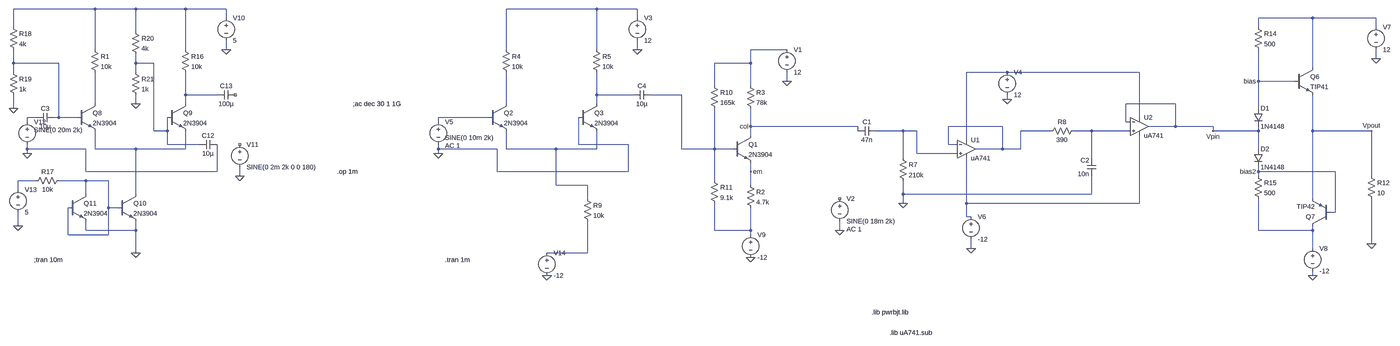
[diagram p0: schematic ampsave.asc, whole sheet]
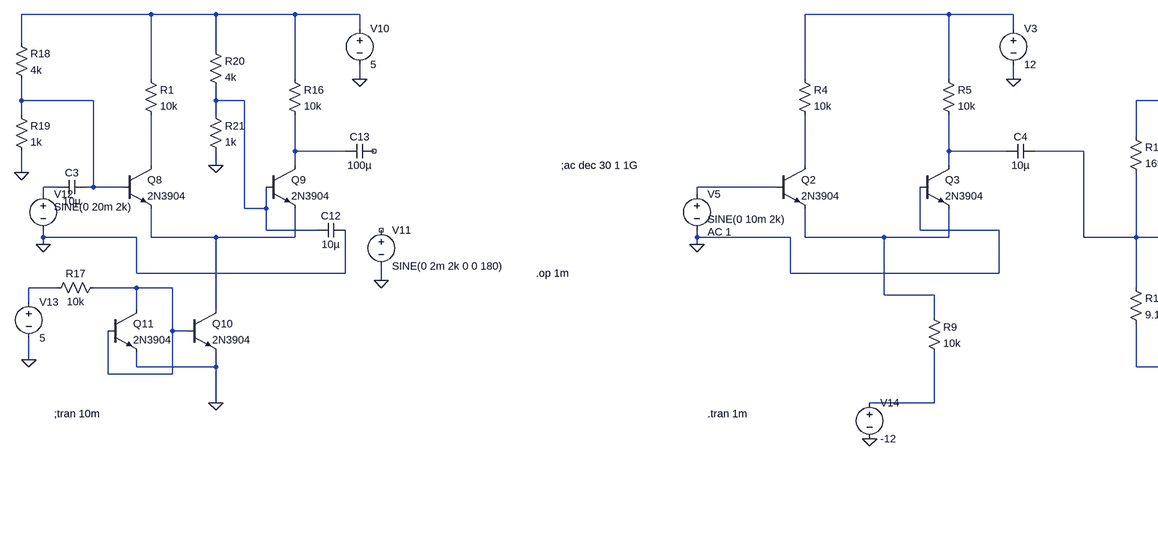
[diagram p1: schematic ampsave.asc, part, row 1 of 1, column 1 of 2]
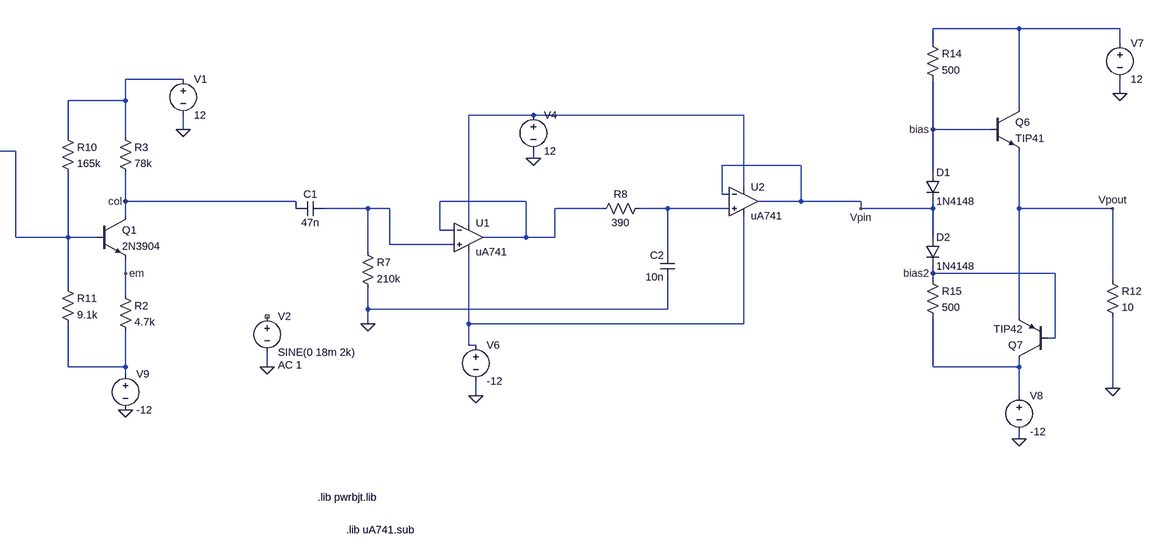
[diagram p2: schematic ampsave.asc, part, row 1 of 1, column 2 of 2]
ampsave.asc, the LTspice schematic file:
Version 4
SHEET 1 3068 1096
WIRE -2784 -352 -3072 -352
WIRE -2640 -352 -2784 -352
WIRE -2464 -352 -2640 -352
WIRE -2320 -352 -2464 -352
WIRE -880 -352 -1200 -352
WIRE -736 -352 -880 -352
WIRE -2320 -320 -2320 -352
WIRE -736 -320 -736 -352
WIRE 2672 -320 2480 -320
WIRE 2896 -320 2672 -320
WIRE -3072 -288 -3072 -352
WIRE 2480 -288 2480 -320
WIRE 2896 -288 2896 -320
WIRE -2640 -272 -2640 -352
WIRE -2784 -208 -2784 -352
WIRE -2464 -208 -2464 -352
WIRE -2320 -208 -2320 -240
WIRE -1200 -208 -1200 -352
WIRE -880 -208 -880 -352
WIRE -736 -208 -736 -240
WIRE 336 -208 208 -208
WIRE 2896 -176 2896 -208
WIRE -3072 -160 -3072 -208
WIRE -2912 -160 -3072 -160
WIRE -2640 -160 -2640 -192
WIRE -2576 -160 -2640 -160
WIRE 208 -160 208 -208
WIRE 208 -160 80 -160
WIRE 2672 -144 2672 -320
WIRE -3072 -128 -3072 -160
WIRE -2640 -128 -2640 -160
WIRE 1120 -128 976 -128
WIRE 1776 -128 1120 -128
WIRE 336 -96 336 -128
WIRE 2480 -96 2480 -208
WIRE 2608 -96 2480 -96
WIRE 80 -80 80 -160
WIRE 208 -80 208 -160
WIRE -2464 -48 -2464 -128
WIRE -2352 -48 -2464 -48
WIRE -880 -48 -880 -128
WIRE -752 -48 -880 -48
WIRE -48 -48 -688 -48
WIRE 1120 -32 1120 -48
WIRE -2784 -16 -2784 -128
WIRE -2640 -16 -2640 -48
WIRE -2464 -16 -2464 -48
WIRE -1200 -16 -1200 -128
WIRE -880 -16 -880 -48
WIRE 1904 -16 1728 -16
WIRE -3072 0 -3072 -48
WIRE 2480 0 2480 -96
WIRE -2992 32 -3024 32
WIRE -2912 32 -2912 -160
WIRE -2912 32 -2928 32
WIRE -2848 32 -2912 32
WIRE -1264 32 -1440 32
WIRE 1776 32 1776 -128
WIRE -3024 48 -3024 32
WIRE -1440 48 -1440 32
WIRE 1728 48 1728 -16
WIRE 1744 48 1728 48
WIRE 208 64 208 0
WIRE 592 64 208 64
WIRE 1104 64 912 64
WIRE 1904 64 1904 -16
WIRE 1904 64 1808 64
WIRE 2320 64 1904 64
WIRE -2576 80 -2576 -160
WIRE -2528 80 -2528 32
WIRE -2528 80 -2576 80
WIRE 592 80 592 64
WIRE 752 80 656 80
WIRE 800 80 752 80
WIRE 1296 80 1168 80
WIRE 1440 80 1376 80
WIRE 1744 80 1440 80
WIRE 2320 80 2320 64
WIRE 2480 80 2480 64
WIRE 2480 80 2320 80
WIRE 2672 80 2672 -48
WIRE 2880 80 2672 80
WIRE 208 96 208 64
WIRE 976 112 976 -128
WIRE -2528 128 -2528 80
WIRE -2416 128 -2528 128
WIRE -944 128 -944 32
WIRE -768 128 -944 128
WIRE 912 128 912 64
WIRE 944 128 912 128
WIRE -3024 144 -3024 128
WIRE -2816 144 -3024 144
WIRE -2784 144 -2784 80
WIRE -2640 144 -2784 144
WIRE -2464 144 -2464 80
WIRE -2464 144 -2640 144
WIRE -1440 144 -1440 128
WIRE -1232 144 -1440 144
WIRE -1200 144 -1200 80
WIRE -1024 144 -1200 144
WIRE -880 144 -880 80
WIRE -880 144 -1024 144
WIRE -48 144 -48 -48
WIRE 80 144 80 0
WIRE 80 144 -48 144
WIRE 144 144 80 144
WIRE 1104 144 1104 64
WIRE 1104 144 1008 144
WIRE 1168 144 1168 80
WIRE 1168 144 1104 144
WIRE 2480 144 2480 80
WIRE -3024 160 -3024 144
WIRE -1440 160 -1440 144
WIRE 800 160 800 80
WIRE 944 160 800 160
WIRE 752 176 752 80
WIRE 1440 176 1440 80
WIRE -2816 224 -2816 144
WIRE -2352 224 -2352 128
WIRE -2352 224 -2816 224
WIRE -1232 224 -1232 144
WIRE -768 224 -768 128
WIRE -768 224 -1232 224
WIRE 208 224 208 192
WIRE 2480 224 2480 208
WIRE 2752 224 2480 224
WIRE -2272 240 -2272 208
WIRE 2480 240 2480 224
WIRE 2880 240 2880 80
WIRE -2992 256 -3056 256
WIRE -2816 256 -2912 256
WIRE -2736 256 -2816 256
WIRE 80 256 80 144
WIRE -1024 272 -1024 144
WIRE -912 272 -1024 272
WIRE 208 272 208 224
WIRE -3056 288 -3056 256
WIRE -2816 304 -2816 256
WIRE -2640 304 -2640 144
WIRE 752 304 752 256
WIRE 1440 304 1440 240
WIRE 1440 304 752 304
WIRE -912 320 -912 272
WIRE 2672 320 2672 80
WIRE 752 336 752 304
WIRE 976 336 976 176
WIRE 1776 336 1776 96
WIRE 1776 336 976 336
WIRE -2736 352 -2736 256
WIRE -2704 352 -2736 352
WIRE 2752 368 2752 224
WIRE 2752 368 2736 368
WIRE 976 384 976 336
WIRE 992 384 976 384
WIRE -3056 416 -3056 368
WIRE -2816 432 -2816 400
WIRE -2640 432 -2640 400
WIRE -2640 432 -2816 432
WIRE 80 432 80 336
WIRE 208 432 208 352
WIRE 208 432 80 432
WIRE 528 432 528 400
WIRE 2480 432 2480 320
WIRE 2672 432 2672 416
WIRE 2672 432 2480 432
WIRE -2880 448 -2880 352
WIRE -2736 448 -2736 352
WIRE -2736 448 -2880 448
WIRE 208 448 208 432
WIRE 2880 480 2880 320
WIRE 992 496 992 464
WIRE 2672 496 2672 432
WIRE -2640 512 -2640 432
WIRE -912 512 -912 400
WIRE -912 512 -1056 512
WIRE 2672 592 2672 576
FLAG 528 432 0
FLAG 336 -96 0
FLAG -736 -208 0
FLAG 752 336 0
FLAG -1440 160 0
FLAG 2896 -176 0
FLAG 208 528 0
FLAG -2640 512 0
FLAG -2320 -208 0
FLAG -3024 160 0
FLAG -2272 240 0
FLAG -3056 416 0
FLAG -3072 0 0
FLAG -2640 -16 0
FLAG -1056 592 0
FLAG 208 64 col
FLAG 208 224 em
FLAG 992 496 0
FLAG 1120 -32 0
FLAG 2672 592 0
FLAG 2880 80 Vpout
FLAG 2320 80 Vpin
FLAG 2480 -96 bias
FLAG 2480 224 bias2
FLAG 2880 480 0
DATAFLAG 2880 80 ""
DATAFLAG 2704 80 ""
SYMBOL npn 144 96 R0
SYMATTR InstName Q1
SYMATTR Value 2N3904
SYMBOL res 192 -96 R0
SYMATTR InstName R3
SYMATTR Value 78k
SYMBOL voltage 336 -224 R0
WINDOW 123 0 0 Left 0
WINDOW 39 0 0 Left 0
SYMATTR InstName V1
SYMATTR Value 12
SYMBOL voltage 528 304 R0
WINDOW 123 24 124 Left 2
WINDOW 39 0 0 Left 0
SYMATTR Value2 AC 1
SYMATTR InstName V2
SYMATTR Value SINE(0 18m 2k)
SYMBOL res -1216 -224 R0
SYMATTR InstName R4
SYMATTR Value 10k
SYMBOL res -896 -224 R0
SYMATTR InstName R5
SYMATTR Value 10k
SYMBOL npn -1264 -16 R0
SYMATTR InstName Q2
SYMATTR Value 2N3904
SYMBOL npn -944 -16 R0
SYMATTR InstName Q3
SYMATTR Value 2N3904
SYMBOL voltage -736 -336 R0
WINDOW 123 0 0 Left 0
WINDOW 39 0 0 Left 0
SYMATTR InstName V3
SYMATTR Value 12
SYMBOL res 736 160 R0
SYMATTR InstName R7
SYMATTR Value 210k
SYMBOL res 1392 64 R90
WINDOW 0 0 56 VBottom 2
WINDOW 3 32 56 VTop 2
SYMATTR InstName R8
SYMATTR Value 390
SYMBOL cap 656 64 R90
WINDOW 0 0 32 VBottom 2
WINDOW 3 32 32 VTop 2
SYMATTR InstName C1
SYMATTR Value 47n
SYMBOL cap 1456 240 R180
WINDOW 0 24 56 Left 2
WINDOW 3 24 8 Left 2
SYMATTR InstName C2
SYMATTR Value 10n
SYMBOL voltage -1440 32 R0
WINDOW 123 24 100 Left 2
WINDOW 39 0 0 Left 0
WINDOW 3 24 72 Left 2
SYMATTR Value2 AC 1
SYMATTR Value SINE(0 10m 2k)
SYMATTR InstName V5
SYMBOL npn 2608 -144 R0
SYMATTR InstName Q6
SYMATTR Value TIP41
SYMBOL pnp 2736 416 R180
SYMATTR InstName Q7
SYMATTR Value TIP42
SYMBOL res 2464 -304 R0
SYMATTR InstName R14
SYMATTR Value 500
SYMBOL voltage 2896 -304 R0
WINDOW 123 0 0 Left 0
WINDOW 39 0 0 Left 0
SYMATTR InstName V7
SYMATTR Value 12
SYMBOL diode 2464 0 R0
SYMATTR InstName D1
SYMATTR Value 1N4148
SYMBOL diode 2464 144 R0
SYMATTR InstName D2
SYMATTR Value 1N4148
SYMBOL res 2464 224 R0
SYMATTR InstName R15
SYMATTR Value 500
SYMBOL voltage 208 432 R0
WINDOW 123 0 0 Left 0
WINDOW 39 0 0 Left 0
SYMATTR InstName V9
SYMATTR Value -12
SYMBOL res -2800 -224 R0
SYMATTR InstName R1
SYMATTR Value 10k
SYMBOL res -2480 -224 R0
SYMATTR InstName R16
SYMATTR Value 10k
SYMBOL res -2896 240 R90
WINDOW 0 0 56 VBottom 2
WINDOW 3 32 56 VTop 2
SYMATTR InstName R17
SYMATTR Value 10k
SYMBOL npn -2848 -16 R0
SYMATTR InstName Q8
SYMATTR Value 2N3904
SYMBOL npn -2528 -16 R0
SYMATTR InstName Q9
SYMATTR Value 2N3904
SYMBOL npn -2704 304 R0
SYMATTR InstName Q10
SYMATTR Value 2N3904
SYMBOL npn -2880 304 R0
SYMATTR InstName Q11
SYMATTR Value 2N3904
SYMBOL voltage -2320 -336 R0
WINDOW 123 0 0 Left 0
WINDOW 39 0 0 Left 0
SYMATTR InstName V10
SYMATTR Value 5
SYMBOL voltage -2272 112 R0
WINDOW 123 0 0 Left 0
WINDOW 39 0 0 Left 0
SYMATTR InstName V11
SYMATTR Value SINE(0 2m 2k 0 0 180)
SYMBOL voltage -3024 32 R0
WINDOW 123 0 0 Left 0
WINDOW 39 0 0 Left 0
WINDOW 3 24 44 Left 2
SYMATTR Value SINE(0 20m 2k)
SYMATTR InstName V12
SYMBOL voltage -3056 272 R0
WINDOW 123 0 0 Left 0
WINDOW 39 0 0 Left 0
SYMATTR InstName V13
SYMATTR Value 5
SYMBOL res -3088 -304 R0
SYMATTR InstName R18
SYMATTR Value 4k
SYMBOL res -3088 -144 R0
SYMATTR InstName R19
SYMATTR Value 1k
SYMBOL cap -2928 16 R90
WINDOW 0 0 32 VBottom 2
WINDOW 3 32 32 VTop 2
SYMATTR InstName C3
SYMATTR Value 10µ
SYMBOL cap -2352 112 R90
WINDOW 0 0 32 VBottom 2
WINDOW 3 32 32 VTop 2
SYMATTR InstName C12
SYMATTR Value 10µ
SYMBOL res -2656 -288 R0
SYMATTR InstName R20
SYMATTR Value 4k
SYMBOL res -2656 -144 R0
SYMATTR InstName R21
SYMATTR Value 1k
SYMBOL cap -2288 -64 R90
WINDOW 0 0 32 VBottom 2
WINDOW 3 32 32 VTop 2
SYMATTR InstName C13
SYMATTR Value 100µ
SYMBOL voltage -1056 496 R0
WINDOW 123 0 0 Left 0
WINDOW 39 0 0 Left 0
SYMATTR InstName V14
SYMATTR Value -12
SYMBOL res -928 304 R0
SYMATTR InstName R9
SYMATTR Value 10k
SYMBOL res 192 256 R0
SYMATTR InstName R2
SYMATTR Value 4.7k
SYMBOL res 64 -96 R0
SYMATTR InstName R10
SYMATTR Value 165k
SYMBOL res 64 240 R0
SYMATTR InstName R11
SYMATTR Value 9.1k
SYMBOL cap -688 -64 R90
WINDOW 0 0 32 VBottom 2
WINDOW 3 32 32 VTop 2
SYMATTR InstName C4
SYMATTR Value 10µ
SYMBOL OpAmps\\opamp2 976 80 R0
SYMATTR InstName U1
SYMATTR Value uA741
SYMBOL voltage 1120 -144 R0
WINDOW 123 0 0 Left 0
WINDOW 39 0 0 Left 0
SYMATTR InstName V4
SYMATTR Value 12
SYMBOL voltage 992 368 R0
WINDOW 123 0 0 Left 0
WINDOW 39 0 0 Left 0
SYMATTR InstName V6
SYMATTR Value -12
SYMBOL voltage 2672 480 R0
WINDOW 123 0 0 Left 0
WINDOW 39 0 0 Left 0
SYMATTR InstName V8
SYMATTR Value -12
SYMBOL res 2864 224 R0
SYMATTR InstName R12
SYMATTR Value 10
SYMBOL OpAmps\\opamp2 1776 0 R0
SYMATTR InstName U2
SYMATTR Value uA741
TEXT -1416 536 Left 2 !.tran 1m
TEXT -1928 224 Left 2 !.op 1m
TEXT -1872 -16 Left 2 !;ac dec 30 1 1G
TEXT -3000 536 Left 2 !;tran 10m
TEXT 704 1056 Left 2 !.lib uA741.sub
TEXT 640 984 Left 2 !.lib pwrbjt.lib

The netlist it stands for:
* ampsave.asc
Q1 col N010 em 0 2N3904
R3 N004 col 78k
V1 N004 0 12
V2 NC_01 0 SINE(0 18m 2k) AC 1
R4 N002 N012 10k
R5 N002 N009 10k
Q2 N012 N014 N019 0 2N3904
Q3 N009 0 N019 0 2N3904
V3 N002 0 12
R7 N016 0 210k
R8 N017 N015 390
C1 N016 col 47n
C2 0 N017 10n
V5 N014 0 SINE(0 10m 2k) AC 1
Q6 N003 bias Vpout 0 TIP41
Q7 N024 bias2 Vpout 0 TIP42
R14 N003 bias 500
V7 N003 0 12
D1 bias Vpin 1N4148
D2 Vpin bias2 1N4148
R15 bias2 N024 500
V9 N023 0 -12
R1 N001 N011 10k
R16 N001 N008 10k
R17 N021 N020 10k
Q8 N011 N005 N018 0 2N3904
Q9 N008 N006 N018 0 2N3904
Q10 N018 N021 0 0 2N3904
Q11 N021 N021 0 0 2N3904
V10 N001 0 5
V11 NC_02 0 SINE(0 2m 2k 0 0 180)
V12 N013 0 SINE(0 20m 2k)
V13 N020 0 5
R18 N001 N005 4k
R19 N005 0 1k
C3 N005 N013 10µ
C12 0 N006 10µ
R20 N001 N006 4k
R21 N006 0 1k
C13 NC_03 N008 100µ
V14 N025 0 -12
R9 N019 N025 10k
R2 em N023 4.7k
R10 N004 N010 165k
R11 N010 N023 9.1k
C4 N010 N009 10µ
XU1 N016 N015 N007 N022 N015 uA741  ; pins In+ In- V+ V- OUT
V4 N007 0 12
V6 N022 0 -12
V8 N024 0 -12
R12 Vpout 0 10
XU2 N017 Vpin N007 N022 Vpin uA741  ; pins In+ In- V+ V- OUT
.model D D
.lib standard.dio
.model NPN NPN
.model PNP PNP
.lib standard.bjt
.tran 1m
.op 1m
;ac dec 30 1 1G
;tran 10m
.lib uA741.sub
.lib pwrbjt.lib
.backanno
.end